# Altium schematic sheet E16-PDB-5-LOAD_1.SchDoc
size A4
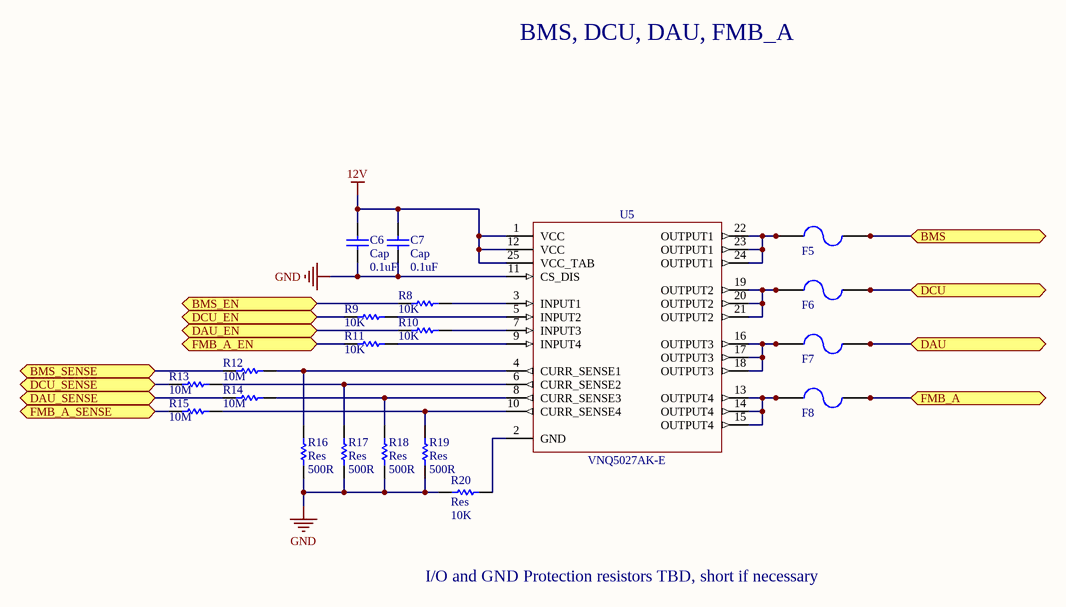
[diagram p0: E16-PDB-5-LOAD_1.SchDoc]

## Parts
C6  Cap  value 0.1uF  [C0805]
C7  Cap  value 0.1uF  [C0805]
F5  BK-6013  [BK-6013]  (value not drawn)
F6  BK-6013  [BK-6013]  (value not drawn)
F7  BK-6013  [BK-6013]  (value not drawn)
F8  BK-6013  [BK-6013]  (value not drawn)
R8  value 10K  [2012[0805]]  (hidden comment: Res)
R9  value 10K  [2012[0805]]  (hidden comment: Res)
R10  value 10K  [2012[0805]]  (hidden comment: Res)
R11  value 10K  [2012[0805]]  (hidden comment: Res)
R12  value 10M  [2012[0805]]  (hidden comment: Res)
R13  value 10M  [2012[0805]]  (hidden comment: Res)
R14  value 10M  [2012[0805]]  (hidden comment: Res)
R15  value 10M  [2012[0805]]  (hidden comment: Res)
R16  Res  value 500R  [2012[0805]]
R17  Res  value 500R  [2012[0805]]
R18  Res  value 500R  [2012[0805]]
R19  Res  value 500R  [2012[0805]]
R20  Res  value 10K  [2012[0805]]
U5  MFG_PN: VNQ5027AK-E  [PowerSSO-24]  (hidden comment: U_VNQ5027AK-E)

## Ports
BMS, BMS_EN, BMS_SENSE, DAU, DAU_EN, DAU_SENSE, DCU, DCU_EN, DCU_SENSE, FMB_A, FMB_A_EN, FMB_A_SENSE

## Nets
12V: C6.2 C7.2 U5.1(VCC) U5.12(VCC) U5.25(VCC_TAB)
GND: C6.1 C7.1 R16.1 R17.1 R18.1 R19.1 R20.2 U5.11(CS_DIS)
BMS: F5.3 F5.4 ; port BMS
BMS_EN: R8.2 ; port BMS_EN
BMS_SENSE: R12.2 ; port BMS_SENSE
DAU: F7.3 F7.4 ; port DAU
DAU_EN: R10.2 ; port DAU_EN
DAU_SENSE: R14.2 ; port DAU_SENSE
DCU: F6.3 F6.4 ; port DCU
DCU_EN: R9.2 ; port DCU_EN
DCU_SENSE: R13.2 ; port DCU_SENSE
FMB_A: F8.3 F8.4 ; port FMB_A
FMB_A_EN: R11.2 ; port FMB_A_EN
FMB_A_SENSE: R15.2 ; port FMB_A_SENSE
NetF5_1: F5.1 F5.2 U5.22(OUTPUT1) U5.23(OUTPUT1) U5.24(OUTPUT1)
NetF6_1: F6.1 F6.2 U5.19(OUTPUT2) U5.20(OUTPUT2) U5.21(OUTPUT2)
NetF7_1: F7.1 F7.2 U5.16(OUTPUT3) U5.17(OUTPUT3) U5.18(OUTPUT3)
NetF8_1: F8.1 F8.2 U5.13(OUTPUT4) U5.14(OUTPUT4) U5.15(OUTPUT4)
NetR8_1: R8.1 U5.3(INPUT1)
NetR9_1: R9.1 U5.5(INPUT2)
NetR10_1: R10.1 U5.7(INPUT3)
NetR11_1: R11.1 U5.9(INPUT4)
NetR12_1: R12.1 R16.2 U5.4(CURR_SENSE1)
NetR13_1: R13.1 R17.2 U5.6(CURR_SENSE2)
NetR14_1: R14.1 R18.2 U5.8(CURR_SENSE3)
NetR15_1: R15.1 R19.2 U5.10(CURR_SENSE4)
NetR20_1: R20.1 U5.2(GND)

## Notes on the sheet
- BMS, DCU, DAU, FMB_A
- I/O and GND Protection resistors TBD, short if necessary

## Library data of the parts
C6 C7 = Cap: Capacitor; Published: 8-Jun-2000; LatestRevisionDate: 17-Jul-2002; LatestRevisionNote: Re-released for DXP Platform.; PackageReference: C1206; Publisher: Altium Limited
F5-F8 = BK-6013: FUSE HOLDER BLADE PCB; Supplier 1: Digi-Key; Supplier Part Number 1: BK-6013-ND
R8-R20 = Res: Surface Mount Resistor; Published: 8-Jun-2000; LatestRevisionDate: 17-Jul-2002; LatestRevisionNote: Re-released for DXP Platform.; PackageReference: AXIAL-0.5; Publisher: Altium Limited
U5 = U_VNQ5027AK-E: LOAD CHANNEL HIGH SIDE 42 A 4 Channel; MFG: STmicroelectronics; Supplier 1: Digi-Key; Supplier Part Number 1: 497-11715-1-ND